# EAGLE design solar_harvester (EAGLE 9.5.1)

## Sheet 1 of 2
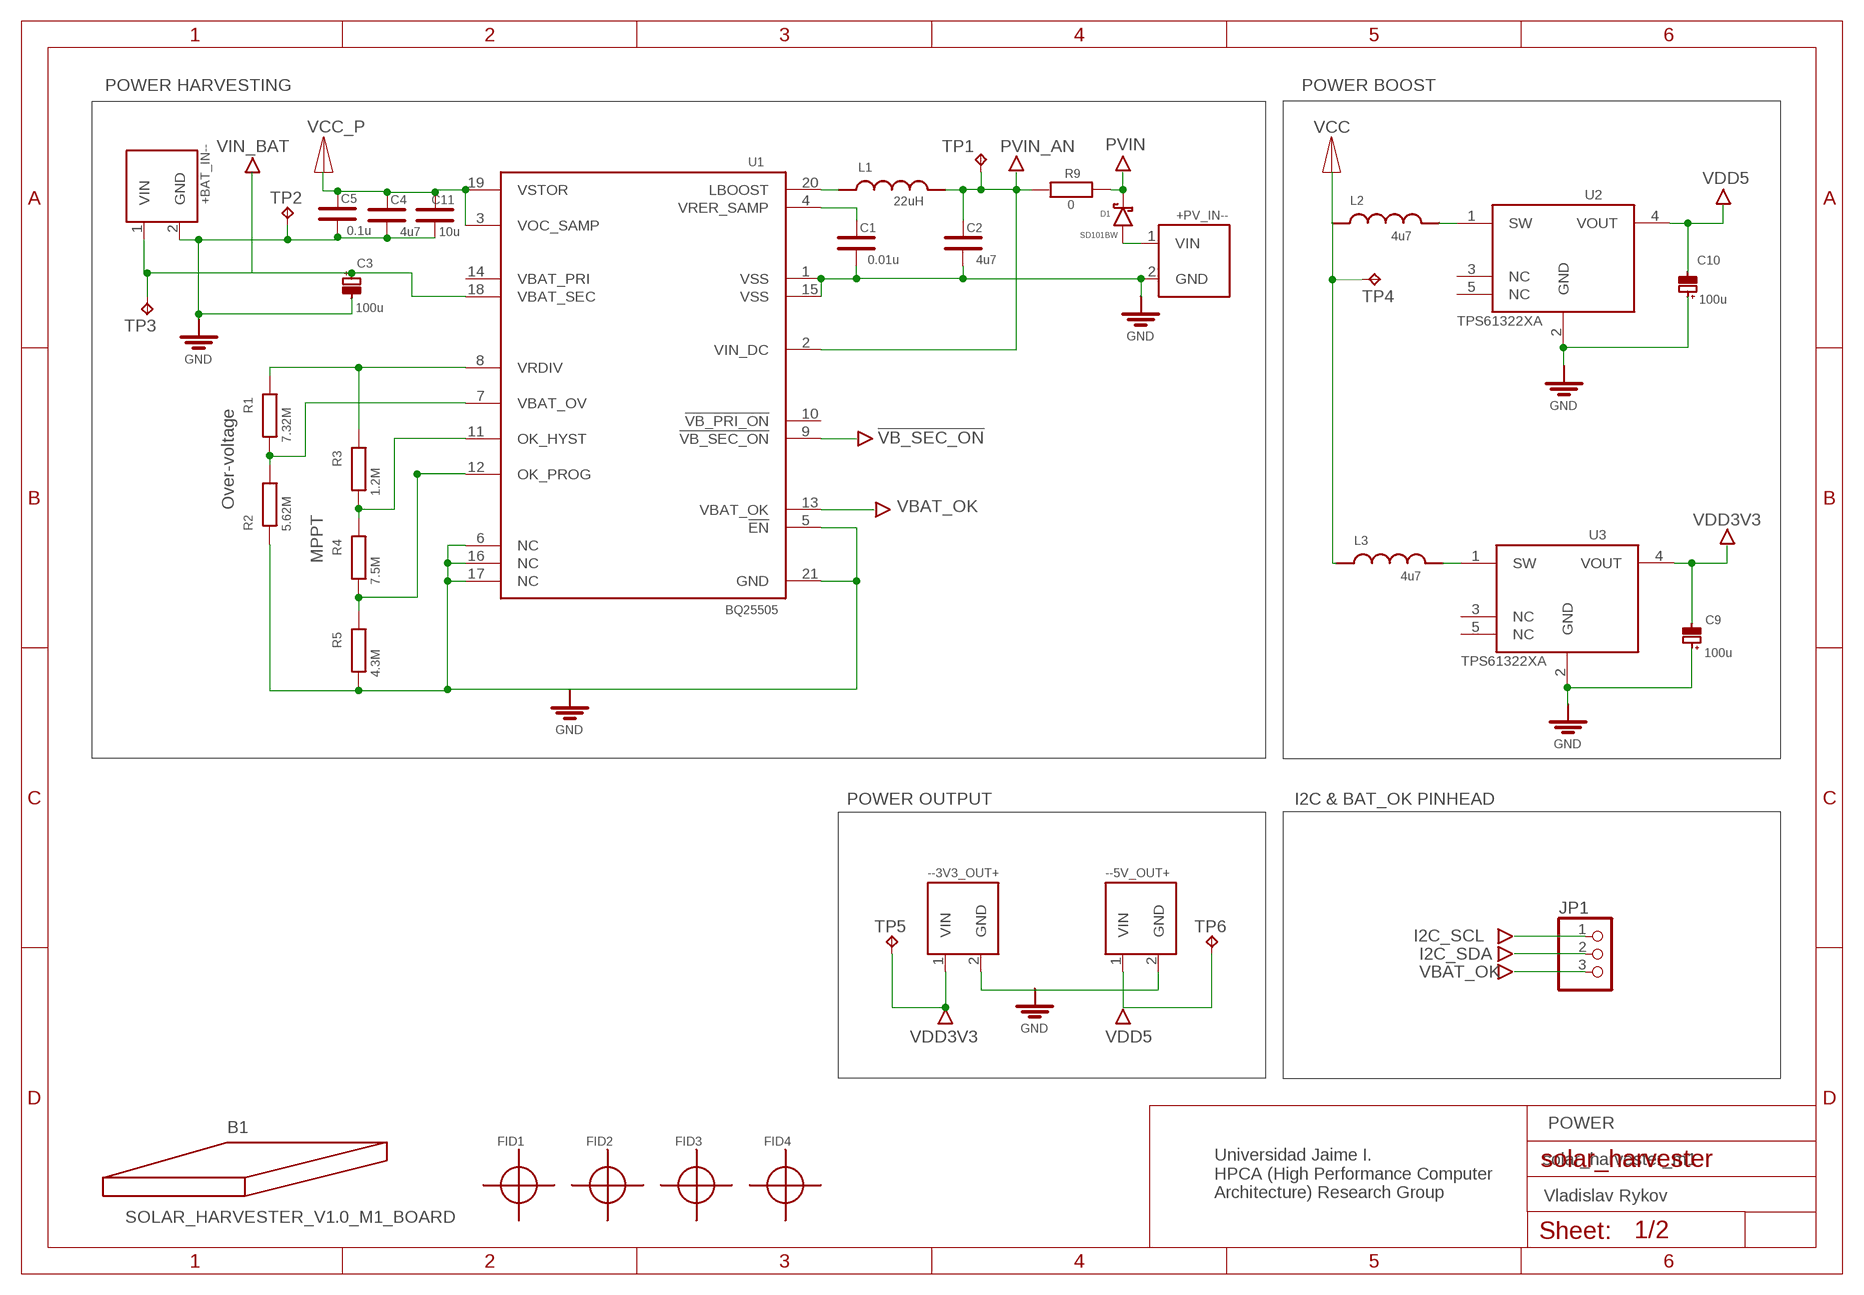
[diagram p0: schematic, sheet 1]

### Parts
+BAT_IN--  CONN_SCEW_TYPE_2P  [CONN_SCREW_TYPE_2P]
+PV_IN--  CONN_SCEW_TYPE_2P  [CONN_SCREW_TYPE_2P]
--3V3_OUT+  CONN_SCEW_TYPE_2P  [CONN_SCREW_TYPE_2P]
--5V_OUT+  CONN_SCEW_TYPE_2P  [CONN_SCREW_TYPE_2P]
B1  SOLAR_HARVESTER_V1.0_M1_BOARD  [SOLAR_HARVESTER_V1.0_M1_FOOTPRINT]
C1  0.01u  1608_CAP  [1608_FOOTPRINT]
C2  4u7  1608_CAP  [1608_FOOTPRINT]
C3  100u  3528_POL_CAP  [3528_TAN_FOOTPRINT]
C4  4u7  1608_CAP  [1608_FOOTPRINT]
C5  0.1u  1608_CAP  [1608_FOOTPRINT]
C9  100u  3528_POL_CAP  [3528_TAN_FOOTPRINT]
C10  100u  3528_POL_CAP  [3528_TAN_FOOTPRINT]
C11  10u  1608_CAP  [1608_FOOTPRINT]
D1  SD101BW  [SOD-123]
FID1  FIDUCIAL_25  [FIDUCIAL_25]
FID2  FIDUCIAL_25  [FIDUCIAL_25]
FID3  FIDUCIAL_25  [FIDUCIAL_25]
FID4  FIDUCIAL_25  [FIDUCIAL_25]
JP1  PINHD-1X3  [1X03]
L1  22uH  FIXED_4040  [FIXED_4040_FOOTPRINT]
L2  4u7  FIXED_5050  [FIXED_5050_FOOTPRINT]
L3  4u7  FIXED_2520  [FIXED_2520_FOOTPRINT]
R1  7.32M  RESISTOR_1608  [RESISTOR_1608_FOOTPRINT]
R2  5.62M  RESISTOR_1608  [RESISTOR_1608_FOOTPRINT]
R3  1.2M  RESISTOR_1608  [RESISTOR_1608_FOOTPRINT]
R4  7.5M  RESISTOR_1608  [RESISTOR_1608_FOOTPRINT]
R5  4.3M  RESISTOR_1608  [RESISTOR_1608_FOOTPRINT]
R9  0  RESISTOR_1608  [RESISTOR_1608_FOOTPRINT]
TP1  TPTP10SQ  [TP10SQ]
TP2  TPTP10SQ  [TP10SQ]
TP3  TPTP10SQ  [TP10SQ]
TP4  TPTP10SQ  [TP10SQ]
TP5  TPTP10SQ  [TP10SQ]
TP6  TPTP10SQ  [TP10SQ]
U1  BQ25505  [BQ25505_FOOTPRINT]
U2  TPS61322XA  [TPS61322XA_FOOTPRINT]
U3  TPS61322XA  [TPS61322XA_FOOTPRINT]

### Nets
!VB_SEC_ON!: U1.9(!VB_SEC_ON!) ; also sheet 2
GND: +BAT_IN--.2(GND) +PV_IN--.2(GND) --3V3_OUT+.2(GND) --5V_OUT+.2(GND) C1.2 C2.2 C3.2 C4.2 C5.2 C9.1 C10.1 C11.2 R2.1 R5.1 TP2.TP U1.1(VSS) U1.5(!EN!) U1.6(NC) U1.15(VSS) U1.16(NC) U1.17(NC) U1.21(GND) U2.2(GND) U3.2(GND) ; also sheet 2
I2C_SCL: JP1.1 ; also sheet 2
I2C_SDA: JP1.2 ; also sheet 2
N$1: L1.1 U1.20(LBOOST)
N$2: C1.1 U1.4(VRER_SAMP)
N$3: R1.2 R3.2 U1.8(VRDIV)
N$4: R1.1 R2.2 U1.7(VBAT_OV)
N$5: R3.1 R4.2 U1.11(OK_HYST)
N$6: R4.1 R5.2 U1.12(OK_PROG)
N$7: +PV_IN--.1(VIN) D1.2
N$10: L3.2 U3.1(SW)
N$11: L2.2 U2.1(SW)
PVIN: D1.1 R9.2 ; also sheet 2
PVIN_AN: C2.1 L1.2 R9.1 TP1.TP U1.2(VIN_DC) ; also sheet 2
VBAT_OK: JP1.3 U1.13(VBAT_OK)
VCC: L2.1 L3.1 TP4.TP ; also sheet 2
VCC_P: C4.1 C5.1 C11.1 U1.3(VOC_SAMP) U1.19(VSTOR) ; also sheet 2
VDD3V3: --3V3_OUT+.1(VIN) C9.2 TP5.TP U3.4(VOUT)
VDD5: --5V_OUT+.1(VIN) C10.2 TP6.TP U2.4(VOUT)
VIN_BAT: +BAT_IN--.1(VIN) C3.1 TP3.TP U1.18(VBAT_SEC) ; also sheet 2
Unconnected: U1.10(!VB_PRI_ON!) U1.14(VBAT_PRI) U2.3(NC) U2.5(NC) U3.3(NC) U3.5(NC)

### Notes on the sheet
- POWER HARVESTING | POWER BOOST
- Over-voltage
- MPPT
- POWER OUTPUT | I2C & BAT_OK PINHEAD
- POWER
- solar_harvester_m1
- Universidad Jaime I.
  HPCA (High Performance Computer
  Architecture) Research Group
- Vladislav Rykov

## Sheet 2 of 2
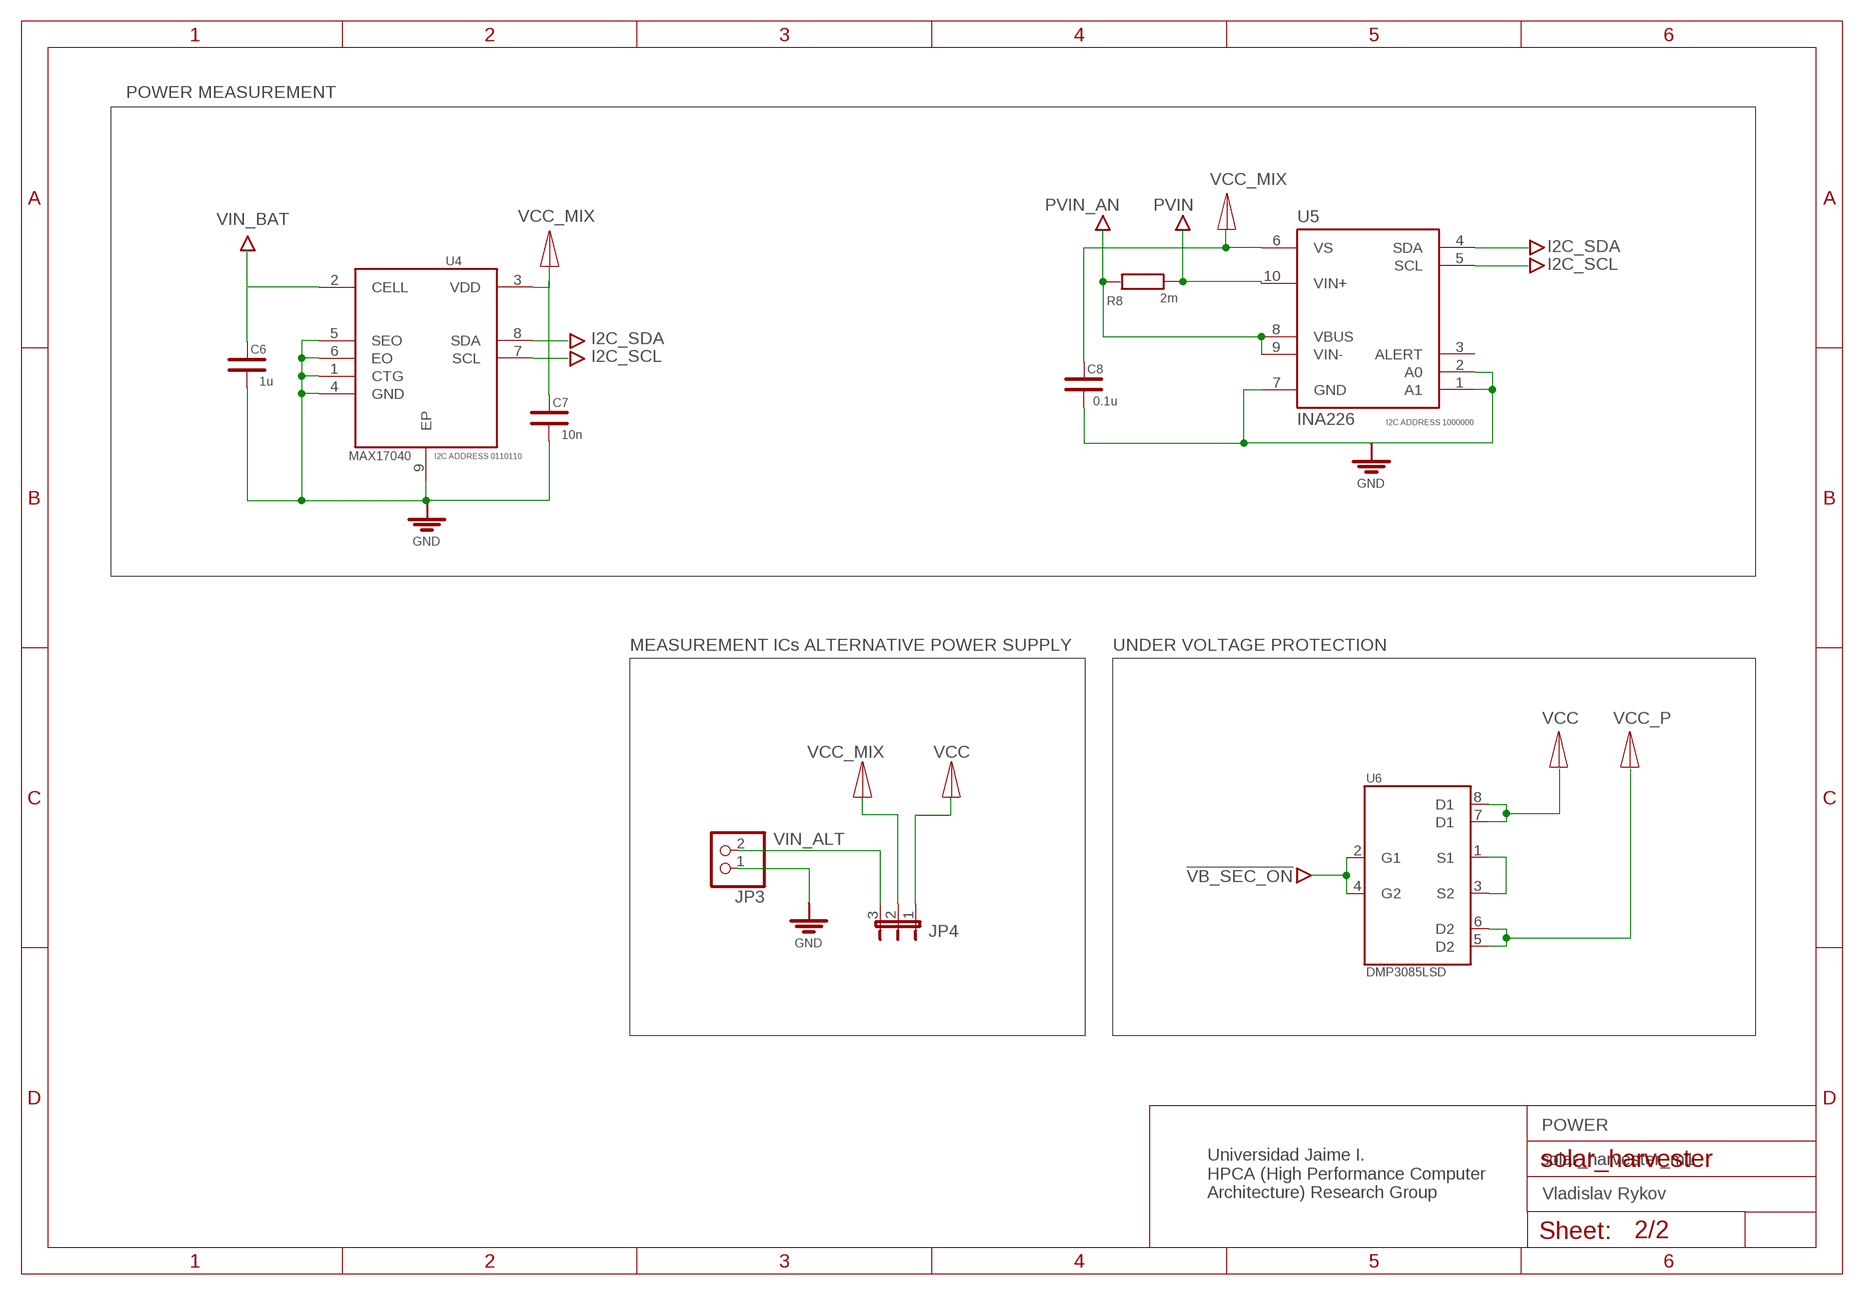
[diagram p1: schematic, sheet 2]

### Parts
C6  1u  1608_CAP  [1608_FOOTPRINT]
C7  10n  1608_CAP  [1608_FOOTPRINT]
C8  0.1u  1608_CAP  [1608_FOOTPRINT]
JP3  PINHD-1X2  [1X02]
JP4  JP2E  [JP2]
R8  2m  RESISTOR_2012  [RESISTOR_2012_FOOTPRINT]
U4  MAX17040  [MAX17040G+T_FOOTPRINT]
U5  INA226  [INA226_FOOTPRINT]
U6  DMP3085LSD  [SO-8]

### Nets
!VB_SEC_ON!: U6.2(G1) U6.4(G2) ; also sheet 1
GND: C6.2 C7.2 C8.2 JP3.1 U4.1(CTG) U4.4(GND) U4.5(SEO) U4.6(EO) U4.9(EP) U5.1(A1) U5.2(A0) U5.7(GND) ; also sheet 1
I2C_SCL: U4.7(SCL) U5.5(SCL) ; also sheet 1
I2C_SDA: U4.8(SDA) U5.4(SDA) ; also sheet 1
N$15: U6.1(S1) U6.3(S2)
PVIN: R8.2 U5.10(VIN+) ; also sheet 1
PVIN_AN: R8.1 U5.8(VBUS) U5.9(VIN-) ; also sheet 1
VCC: JP4.1 U6.7(D1) U6.8(D1) ; also sheet 1
VCC_MIX: C7.1 C8.1 JP4.2 U4.3(VDD) U5.6(VS)
VCC_P: U6.5(D2) U6.6(D2) ; also sheet 1
VIN_ALT: JP3.2 JP4.3
VIN_BAT: C6.1 U4.2(CELL) ; also sheet 1
Unconnected: U5.3(ALERT)

### Notes on the sheet
- POWER MEASUREMENT
- I2C ADDRESS 1000000
- I2C ADDRESS 0110110
- MEASUREMENT ICs ALTERNATIVE POWER SUPPLY | UNDER VOLTAGE PROTECTION
- POWER
- solar_harvester_m1
- Universidad Jaime I.
  HPCA (High Performance Computer
  Architecture) Research Group
- Vladislav Rykov

## Library data of the parts
+BAT_IN-- +PV_IN-- --3V3_OUT+ --5V_OUT+ = vrlib_connector:CONN_SCEW_TYPE_2P
B1 = vrlib_board:SOLAR_HARVESTER_V1.0_M1_BOARD
C1 C2 C4-C8 C11 = vrlib_caps:1608_CAP; MOUNT: SMD; SIZE_CODE: 1608
C3 C9 C10 = vrlib_caps:3528_POL_CAP; MOUNT: SMD; SIZE_CODE: 3528
D1 = vrlib_diode:SD101BW: Switching Schottky Barrier Diode Datasheet <https://www.mouser.es/datasheet/2/395/SD101AW%20SERIES_C1601-1113283.pdf>
FID1-FID4 = vrlib_prod:FIDUCIAL_25
JP1 = pinhead:PINHD-1X3: PIN HEADER
JP3 = pinhead:PINHD-1X2: PIN HEADER
JP4 = vrlib_jumper:JP2E: JUMPER
L1 = vrlib_induc:FIXED_4040; MOUNT: SMD
L2 = vrlib_induc:FIXED_5050; MOUNT: SMD; SIZE: 5050
L3 = vrlib_induc:FIXED_2520; MOUNT: SMD; SIZE_CODE: 2520
R1-R5 R9 = vrlib_res:RESISTOR_1608
R8 = vrlib_res:RESISTOR_2012: SHUNT RESISTOR; MOUNT: SMD; SIZE: 2012
TP1-TP6 = testpad:TP: Test pad
U1 = vrlib_ic:BQ25505: BQ25505 Ultra low-power boost charger with battery management and autonomous power multiplexer for primary battery in energy harvester applications. Datasheet <http://www.ti.com/general/docs/suppproductinfo.tsp?distId=26&gotoUrl=http%3A%2F%2Fwww.ti.com%2Flit%2Fgpn%2Fbq25505>; MOUNT: SMD
U2 U3 = vrlib_ic:TPS61322XA: TPS61322 The TPS61322 is a synchronous boost converter with only 6.5-µA quiescent current. Datasheet <http://www.ti.com/general/docs/suppproductinfo.tsp?distId=26&gotoUrl=http%3A%2F%2Fwww.ti.com%2Flit%2Fds%2Fsymlink%2Ftps61322.pdf>; MOUNT: SMD
U4 = vrlib_ic:MAX17040: MAX17040 The MAX17040/MAX17041 are ultra-compact, low-cost, host-side fuel-gauge systems for lithium-ion (Li+) batter-ies in handheld and portable equipment. The MAX17040 is configured to operate with a single lithium cell. Datasheet <https://www.mouser.es/datasheet/2/256/MAX17040-MAX17041-1515184.pdf>; MOUNT: SMD
U5 = vrlib_ic:INA226: INA266 High-Side or Low-Side Measurement, Bi-Directional Current and Power Monitor with I2C Compatible Interface Datasheet <http://www.ti.com/general/docs/suppproductinfo.tsp?distId=26&gotoUrl=http%3A%2F%2Fwww.ti.com%2Flit%2Fgpn%2Fina226>; MOUNT: SMD; PACKAGE: VSSOP
U6 = vrlib_transistor:DMP3085LSD: DMP3085LSD P-CHANNEL ENHANCEMENT MODE MOSFET Datasheet <https://www.mouser.es/datasheet/2/115/DMP3085LSD-266246.pdf>; MOUNT: SMD; PACKAGE: SO-8

## Board
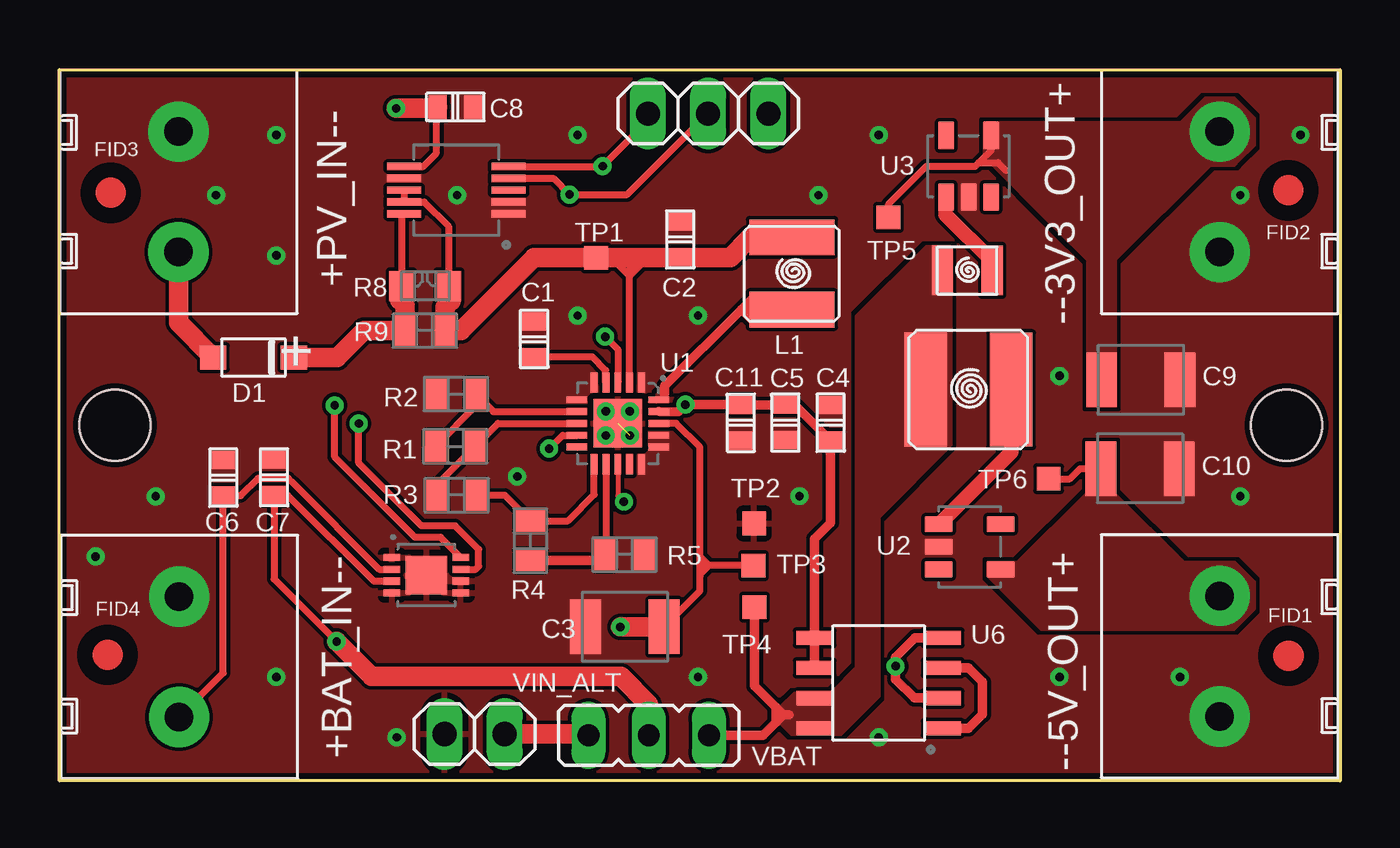
[diagram p2: board, top side]
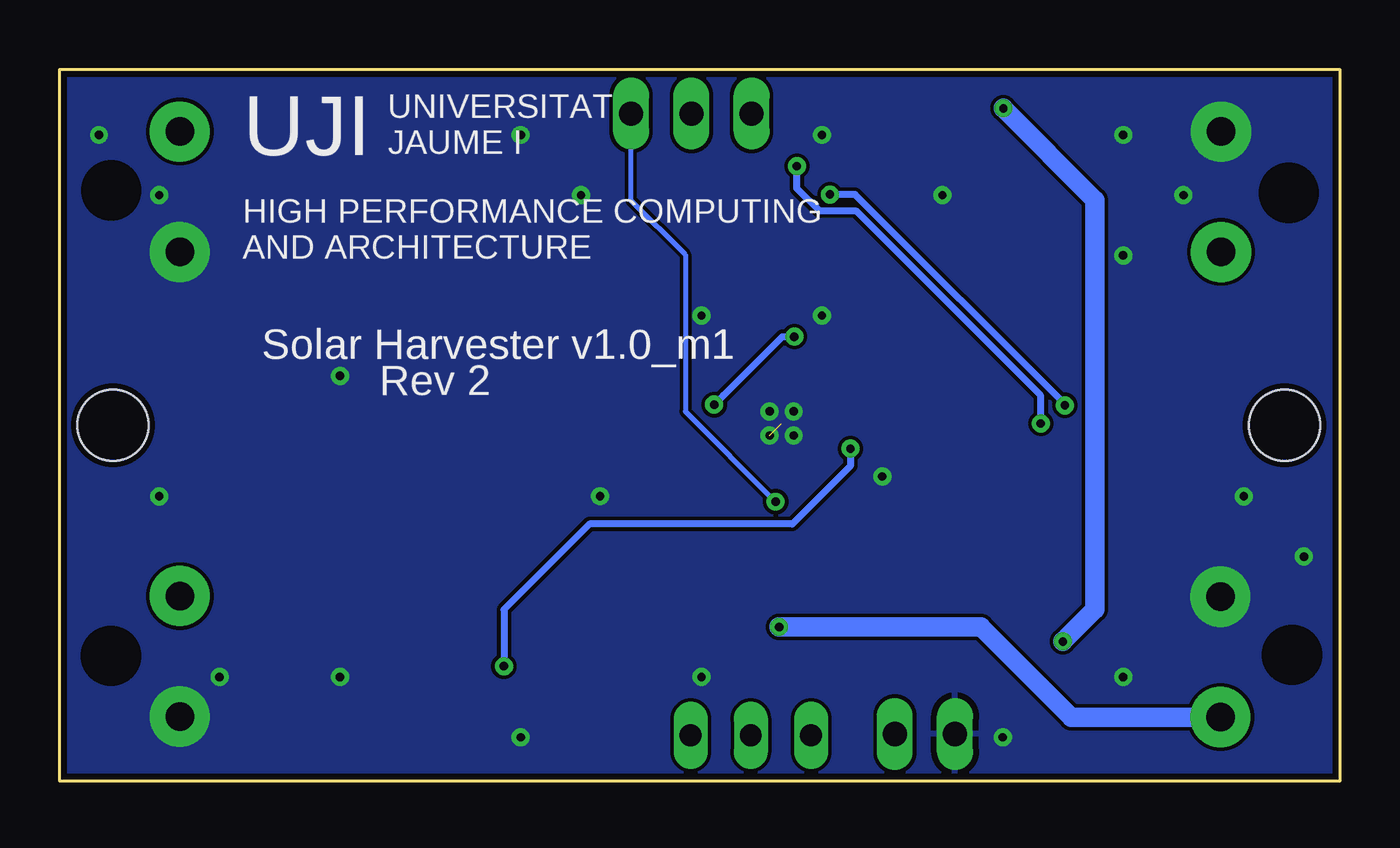
[diagram p3: board, bottom side, seen from below]

Size 54 x 30 mm. Coordinates in mm from the lower left corner, seen from the top.
Copper layers (1*16): Top 0.035mm / dielectric 1.5mm / Bottom 0.035mm
Design rules "default *": minimum track width 6mil, minimum drill 0.35mm, track to track 6mil, track to pad 6mil, pad to pad 6mil, via to via 6mil, smd to smd 6mil, copper to edge 10mil, drill to drill 6mil, minimum pad ring 10mil, minimum via ring 8mil, stop-mask expansion 4mil, vias tented up to drill 0mil, thermal gap 10mil

### Footprints (pad centres in the part's own frame; a part is rotated, then mirrored left to right if it is on the bottom)
CONN_SCREW_TYPE_2P = drill 1.2 pad 2.54: 1 -2.54,0; 2 2.54,0
SOLAR_HARVESTER_V1.0_M1_FOOTPRINT = hole 3: 0,24.658; 0,-24.742
1608_FOOTPRINT = smd 1.016 x 0.762: 1 0,0.75; 2 0,-0.75
3528_TAN_FOOTPRINT = smd 2.3 x 1.3: 1 0,1.65; 2 0,-1.65
SOD-123 = smd 1 x 1.1: 1 0,-1.7; 2 0,1.7
1X03 = drill 1.016 long: 1 -2.54,0; 2 0,0; 3 2.54,0
1X02 = drill 1.016 long: 1 -1.27,0; 2 1.27,0
JP2 = drill 0.914 long: 1 -2.54,0; 2 0,0; 3 2.54,0
FIXED_4040_FOOTPRINT = smd 3.6 x 1.5: 1 0,-1.525; 2 0,1.525
FIXED_5050_FOOTPRINT = smd 4.8 x 1.8: 1 0,1.8; 2 0,-1.8
FIXED_2520_FOOTPRINT = smd 2.1 x 0.9: 1 0,1.05; 2 0,-1.05
RESISTOR_1608_FOOTPRINT = smd 1.27 x 0.889: 1 0,-0.838; 2 0,0.838
RESISTOR_2012_FOOTPRINT = smd 1.27 x 1.02: 1 0,1; 2 0,-1
TP10SQ = smd 1 x 1: TP 0,0
BQ25505_FOOTPRINT = smd 0.287 x 0.857: 1 1,1.725; 2 0.5,1.725; 3 0,1.725; 4 -0.5,1.725; 5 -1,1.725; 11 -1,-1.725; 12 -0.5,-1.725; 13 0,-1.725; 14 0.5,-1.725; 15 1,-1.725 | smd 0.857 x 0.287: 6 -1.725,1; 7 -1.725,0.5; 8 -1.725,0; 9 -1.725,-0.5; 10 -1.725,-1; 16 1.725,-1; 17 1.725,-0.5; 18 1.725,0; 19 1.725,0.5; 20 1.725,1 | smd 2.05 x 2.05: 21 0,0
TPS61322XA_FOOTPRINT = smd 0.67 x 1.17: 1 -0.95,-1.3; 2 0,-1.3; 3 0.95,-1.3; 4 0.95,1.3; 5 -0.95,1.3
MAX17040G+T_FOOTPRINT = smd 0.3 x 0.7: 1 -0.75,-1.45; 2 -0.25,-1.45; 3 0.25,-1.45; 4 0.75,-1.45; 5 0.75,1.45; 6 0.25,1.45; 7 -0.25,1.45; 8 -0.75,1.45 | smd 1.63 x 1.75: 9 0,0
INA226_FOOTPRINT = smd 0.3 x 1.45: 1 -1,-2.2; 2 -0.5,-2.2; 3 0,-2.2; 4 0.5,-2.2; 5 1,-2.2; 6 1,2.2; 7 0.5,2.2; 8 0,2.2; 9 -0.5,2.2; 10 -1,2.2
SO-8 = smd 0.6 x 1.55: 1 -1.905,-2.7; 2 -0.635,-2.7; 3 0.635,-2.7; 4 1.905,-2.7; 5 1.905,2.7; 6 0.635,2.7; 7 -0.635,2.7; 8 -1.905,2.7

### Placement (x,y rotation side)
+BAT_IN--  5.05,5.23 90 top
+PV_IN--  5.03,24.84 90 top
--3V3_OUT+  48.92,24.84 270 top
--5V_OUT+  48.92,5.26 270 top
B1  27,15 90 top
C1  20.02,18.63 180 top
C2  26.17,22.83 180 top
C3  23.84,6.5 270 top
C4  32.52,15.1 180 top
C5  30.61,15.12 0 top
C6  6.92,12.78 180 top
C7  9.05,12.8 180 top
C8  16.7,28.41 90 top
C9  45.59,16.91 270 top
C10  45.56,13.17 270 top
C11  28.74,15.11 0 top
D1  8.19,17.86 90 top
FID1  51.82,5.27 0 top
FID2  51.82,24.91 0 top
FID3  2.16,24.8 0 top
FID4  2.04,5.32 0 top
JP1  27.36,28.14 0 top
JP3  17.51,1.98 0 top
JP4  24.85,1.92 180 top
L1  30.89,21.4 0 top
L2  38.33,16.5 90 top
L3  38.28,21.53 90 top
R1  16.69,14.11 270 top
R2  16.73,16.31 270 top
R3  16.75,12.05 90 top
R4  19.86,10.13 0 top
R5  23.83,9.54 90 top
R8  15.42,20.87 270 top
R9  15.42,18.99 90 top
TP1  22.63,22.06 0 top
TP2  29.29,10.86 0 top
TP3  29.26,9.08 0 top
TP4  29.31,7.33 0 top
TP5  34.96,23.76 0 top
TP6  41.71,12.74 0 top
U1  23.55,15.08 0 top
U2  38.38,9.87 270 top
U3  38.33,25.92 0 top
U4  15.48,8.68 270 top
U5  16.74,24.91 90 top
U6  34.54,4.13 90 top

### Tracks (layer width: path | path; a pad name or v marks a point on that pad's centre or on a via)
!VB_SEC_ON!  (via drill 0.35)
  Top 0.305: v20.65,14.01 21.22,14.58 U1.9
  Top 0.406: U6.4 36.07,6.03 35.26,5.22 v35.26,4.84 35.26,4.28 36.04,3.49 U6.2
  Bottom 0.305: v20.65,14.01 20.65,13.27 23.09,10.83 31.65,10.83 35.26,7.23 v35.26,4.84
GND  (via drill 0.35, 0.35 pad 0.6)  (1 unrouted)
  other vias: 23.04,15.58 23.04,14.57 24.05,15.58 24.05,14.57 21.85,27.24 16.77,24.7 9.15,27.24 6.61,24.7 9.15,22.16 4.07,12 1.53,9.46 9.15,4.38 14.23,1.84 26.93,4.38 19.3,12.84 21.85,19.62 26.93,19.62 32.01,24.7 34.55,27.24 31.2,12.01 34.55,1.84 42.17,4.38 47.25,4.38 49.79,12 52.33,27.24 49.79,24.7 42.17,17.08
  pour Top (rank 6): -0.01,30.1 54.06,30.1 54.06,0 -0.01,0
  pour Bottom (rank 6): -0.01,30 54.06,30 54.06,0 -0.01,0
I2C_SCL  (via drill 0.35)
  Top 0.305: U5.5 22.89,25.91 v22.91,25.93 24.82,27.84 JP1.1 | U4.7 17.55,8.93 17.68,9.05 17.68,9.77 16.69,10.76 15.27,10.76 12.62,13.4 v12.62,15.08
  Bottom 0.305: v12.62,15.08 12.62,16.25 20.42,24.04 21.96,24.04 22.91,24.98 v22.91,25.93
I2C_SDA  (via drill 0.35)
  Top 0.305: U5.4 20.83,25.41 v21.51,24.73 23.94,24.73 JP1.2 | U4.8 16.08,10.27 14.99,10.27 11.61,13.66 v11.61,15.84
  Bottom 0.305: v11.61,15.84 11.61,15.89 20.45,24.73 v21.51,24.73
N$1
  Top 0.152: U1.20 25.52,16.32
  Top 0.406: 25.52,16.32 25.52,16.65 28.75,19.88 | 28.75,19.88 L1.1 | 28.75,19.88 29.28,20.41 29.52,20.41 | 28.75,19.88 | 28.75,19.88 29.26,19.37
  pour Top: 24.87,15.97 25.32,16.42 25.86,16.42 25.86,15.97
N$2
  Top 0.305: U1.4 23.04,17.31 22.47,17.88 C1.1
N$3
  Top 0.305: U1.8 18.5,15.08 R1.2 15.91,12.49 R3.2
N$4
  Top 0.305: R1.1 17.57,15.82 R2.2 18.3,15.58 U1.7
N$5
  Top 0.305: U1.11 22.55,12.07 21.45,10.97 R4.2 18.78,12.05 R3.1
N$6
  Top 0.305: U1.12 23.05,9.62 R5.2
  Top 0.406: R4.1 22.75,9.29 R5.2
N$7
  Top 0.813: +PV_IN--.1 5.03,19.32 D1.2
N$10
  Top 0.61: L3.2 39.33,21.93 37.37,23.89 37.37,24.61 U3.1
N$11
  Top 0.61: U2.1 40.13,13.87 L2.2
N$15
  Top 0.406: U6.3 38.33,4.76 38.92,4.18 38.92,2.81 38.33,2.22 U6.1
PVIN
  Top 0.305: U5.10 14.42,23.8 R8.2
  Top 0.813: R8.2 14.35,20.79 14.35,20.28 14.58,20.05 R9.2 12.84,18.99 11.71,17.86 D1.1
PVIN_AN
  Top 0.305: U5.8 U5.9 15.39,24.41 16.41,23.39 16.41,20.87 R8.1 | 24.03,22.06 24.05,22.05 24.05,21.3 | U1.2 24.05,21.3 | 24.05,21.3 24.81,22.06 24.97,22.06 | 24.05,21.3 23.37,21.97 23.37,22.06
  Top 0.813: R8.1 16.51,20.78 16.51,20.23 16.26,19.98 R9.1 16.94,18.99 20.01,22.06 TP1.TP | TP1.TP 22.61,22.06 | L1.2 30.86,22.9 29.12,22.9 28.29,22.08 C2.1 26.15,22.06 24.97,22.06 24.03,22.06 23.37,22.06 TP1.TP
VBAT_OK  (via drill 0.35)
  Top 0.203: v23.8,11.77 23.55,12.03 U1.13
  Bottom 0.203: v23.8,11.77 27.61,15.58 27.61,22.19 29.9,24.47 JP1.3
VCC
  Top 0.406: JP4.1 29.67,1.92 30.22,2.46 | 31.9,2.17 U6.8 | 37.16,22.24 37.32,22.24 | 36.99,21 36.99,20.97 | 36.53,16.98 L2.1 | 30.53,2.78 30.76,2.78 | 30.22,2.46 30.53,2.78 | 30.22,3.1 30.53,2.78 | TP4.TP 29.31,4 30.19,3.12 30.22,3.1 | 30.22,2.46 30.22,3.1
  pour Top: 37.6,22.54 37.6,14.16 34.55,11.11 34.55,3.57 32.95,1.97 31.04,1.97 30.86,1.97 30.41,2.42 30.41,3.11 30.43,3.14 30.99,3.69 31.14,3.69 32.52,3.69 32.57,3.75 33.61,4.79 33.61,19.59 36.55,22.54
VCC_MIX  (via drill 0.35)
  Top 0.305: U5.6 15.34,25.91 15.9,26.48 15.9,28.36 | U4.3 13.25,8.43 9.63,12.05 C7.1 9.05,8.52 v11.69,5.88
  Top 0.813: v14.2,28.36 15.9,28.36 C8.1 | JP4.2 24.85,3.23 23.68,4.41 13.16,4.41 v11.69,5.88
  Bottom 0.813: v14.2,28.36 10.34,24.5 10.34,7.23 v11.69,5.88
VCC_P  (via drill 0.35)
  Top 0.305: U1.19 25.28,15.58 | v23.01,18.73 23.55,18.2 U1.3
  Top 0.381: 25.28,15.58 26.11,15.58
  Top 0.406: 26.11,15.58 v26.39,15.86 C11.1 C5.1 31,15.87 C4.1 32.52,10.89 31.84,10.21 U6.5 U6.6
  Bottom 0.305: v26.39,15.86 26,16.25 23.52,18.73 v23.01,18.73
VDD3V3
  Top 0.305: TP5.TP 34.96,24.32 36.55,25.92 38.61,25.92 38.76,26.07 | 38.76,26.07 39.28,26.59 U3.4 | 38.76,26.07 39.58,26.07 39.91,25.74
  pour Top: 38.99,27.75 47.27,27.75 48.14,28.61 48.31,28.79 49.51,28.79 49.53,28.79 50.14,28.18 50.37,27.95 50.37,27.06 50.37,26.81 49.71,26.15 49.53,25.97 48.52,25.97 44.53,21.98 44.53,15.81 43.36,15.81 43.36,21.96 42.04,23.28 38.99,26.33
VDD5
  Top 0.305: TP6.TP 42.6,12.74 43.04,13.17 C10.2
  pour Top: 39.15,9.21 39.88,9.21 40.39,9.21 43.31,12.13 43.36,12.18 43.36,14.26 44.5,14.26 44.5,12.1 47.4,9.21 49.56,9.21 50.37,8.39 50.37,7.25 49.51,6.39 48.37,6.39 41.41,6.39 39.15,8.65
VIN_ALT
  Top 0.813: JP3.2 22.25,1.98 JP4.3
VIN_BAT  (via drill 0.35)
  Top 0.305: U1.18 26.01,15.08 27,14.08 27,9.46 | +BAT_IN--.1 6.92,4.56 C6.1 7.65,12.03 8.38,12.76 9.66,12.76 9.86,12.56 | U4.2 13.49,8.93 9.86,12.56 | 9.86,12.56 | C3.1 27,8.01 27,8.6 27,8.7 | 27,8.7 27,9 | 27,9 27,9.46 | TP3.TP 27.38,9.08 | 27.38,9.08 27.08,9.08 27,9 | 27.38,9.08 27,9.46 | 27.38,9.08 27,8.7
  Top 0.813: v23.65,6.49 25.48,6.49 C3.1
  Bottom 0.813: +BAT_IN--.1 11.34,2.69 15.14,6.49 v23.65,6.49

### Text on the board
tPlace: + | VIN_ALT | VBAT
bPlace: UNIVERSITAT / JAUME I | UJI | HIGH PERFORMANCE COMPUTING / AND ARCHITECTURE | Solar Harvester v1.0_m1 | Rev 2
tDocu: VBAT_OK | SCL | SDA | L2